# Altium schematic sheet SHEET1.SCHDOC
size A4
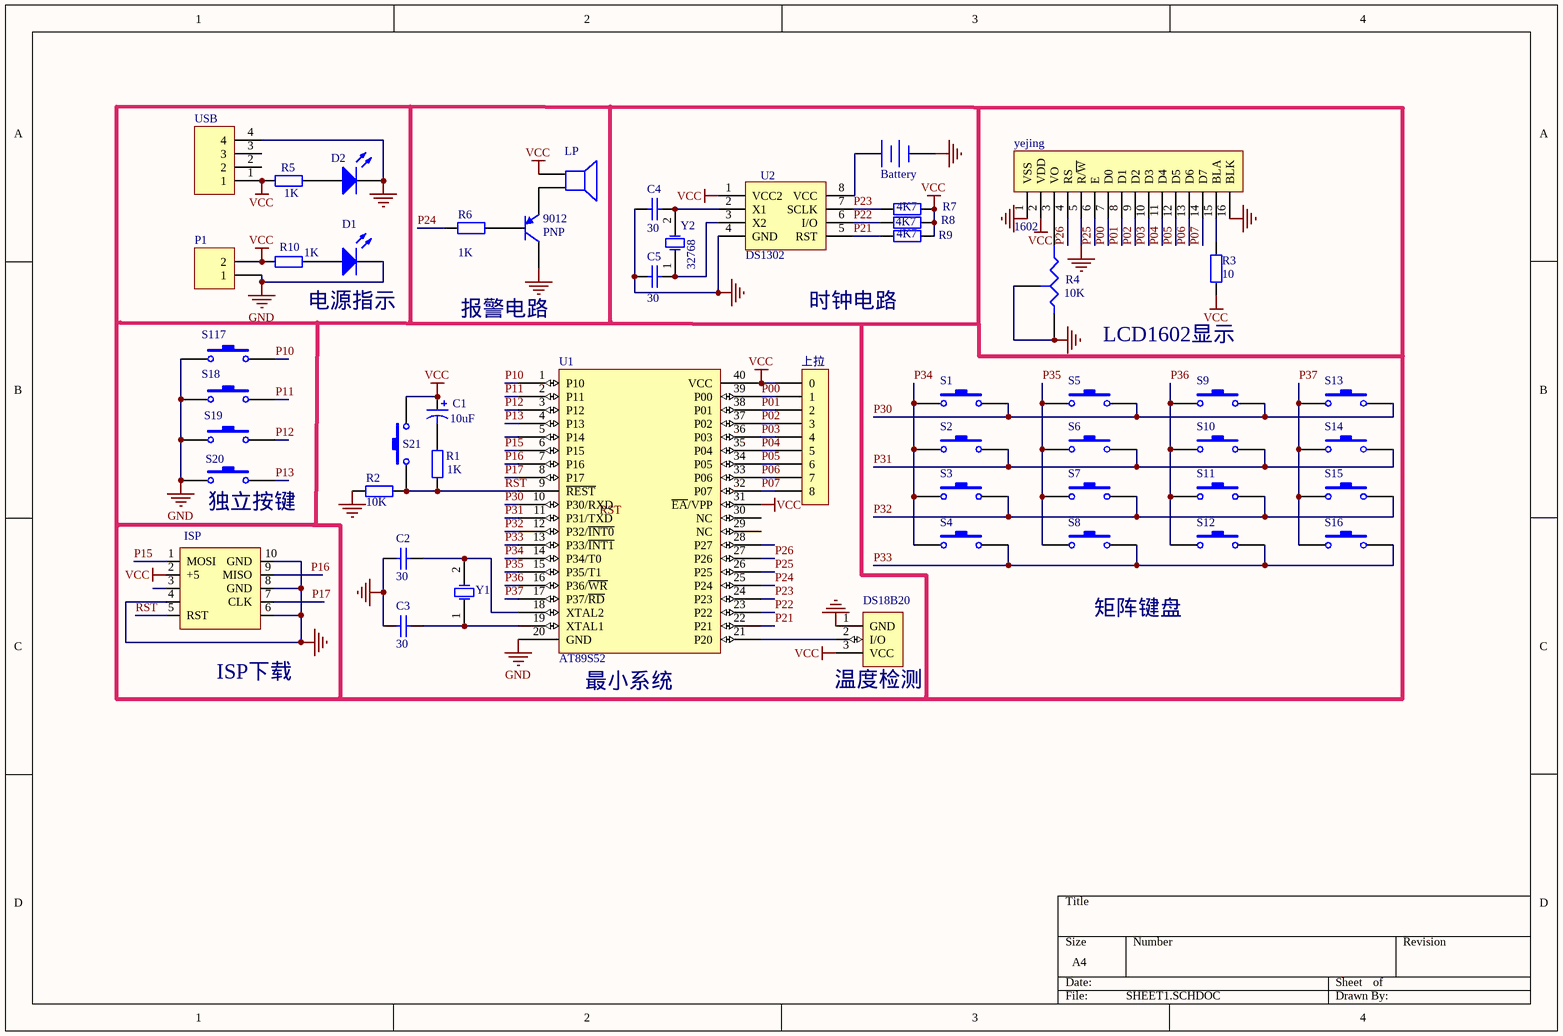
[diagram p0: SHEET1.SCHDOC]

## Parts
(Parts that share a designator on the sheet are numbered #1, #2 ... from top to bottom, then left to right.)
9012  PNP  [三极管]
*  DS18B20  [18B20]
?#1  上拉  [排阻]
?#2  ISP  [ISP]
BA1  Battery  [DIANZI]
C1  value 10uF  [电解电容]  (hidden comment: Cap Pol1)
C2  value 30  [cap]  (hidden comment: Cap)
C3  value 30  [cap]  (hidden comment: Cap)
C4  value 30  [cap]  (hidden comment: Cap)
C5  value 30  [cap]  (hidden comment: Cap)
D1  LED0  [led]  (value not drawn)
D2  LED0  [led]  (value not drawn)
LP  Speaker  [beep]  (value not drawn)
P1  Header 2  [电源]  (value not drawn)
R1  value 1K  [RES]  (hidden comment: Res2)
R2  value 10K  [res]  (hidden comment: Res2)
R3  value 10  [res]  (hidden comment: Res2)
R4  value 10K  [3CZ]  (hidden comment: Res Tap)
R5  value 1K  [RES]  (hidden comment: Res2)
R6  value 1K  [res]  (hidden comment: Res2)
R7  value 4K7  [res]  (hidden comment: Res2)
R8  value 4K7  [res]  (hidden comment: Res2)
R9  value 4K7  [res]  (hidden comment: Res2)
R10  value 1K  [res]  (hidden comment: Res2)
S1  按键  [AJ]  (value not drawn)
S2  按键  [AJ]  (value not drawn)
S3  按键  [AJ]  (value not drawn)
S4  按键  [AJ]  (value not drawn)
S5  按键  [AJ]  (value not drawn)
S6  按键  [AJ]  (value not drawn)
S7  按键  [AJ]  (value not drawn)
S8  按键  [AJ]  (value not drawn)
S9  按键  [AJ]  (value not drawn)
S10  按键  [AJ]  (value not drawn)
S11  按键  [AJ]  (value not drawn)
S12  按键  [AJ]  (value not drawn)
S13  按键  [AJ]  (value not drawn)
S14  按键  [AJ]  (value not drawn)
S15  按键  [AJ]  (value not drawn)
S16  按键  [AJ]  (value not drawn)
S18  SW-PB  [AJ]  (value not drawn)
S19  SW-PB  [AJ]  (value not drawn)
S20  SW-PB  [AJ]  (value not drawn)
S21  SW-PB  [AJ]  (value not drawn)
S117  SW-PB  [AJ]  (value not drawn)
U1  AT89S52  [AT89S52]
U2  DS1302  [DS1302]
USB  ?  [USB]  (value not drawn)
Y1  XTAL  [xtal]  (value not drawn)
Y2  32768  [xtalx]
yejing  1602  [1602]

## Nets
GND: 9012.1(C) *.1(GND) ?#2.4 ?#2.6 ?#2.8(GND) ?#2.10(GND) BA1.2(-) C2.2 C3.2 C4.1 C5.1 D1.2(K) D2.2(K) P1.1 R2.2 R4.1(A) R4.3(TAP) S18.1 S19.1 S20.1 S117.1 U1.20(GND) U2.4(GND) USB.4 yejing.1(VSS) yejing.5(R/~{W}) yejing.16(BLK)
VCC: *.3(VCC) ?#1.0 ?#2.2(+5) C1.1 LP.1 P1.2 R3.1 R5.1 R7.2 R8.2 R9.2 R10.1 S21.2 U1.31(~{EA}/VPP) U1.40(VCC) U2.1(VCC2) USB.1 yejing.2(VDD)
P00: ?#1.1 U1.39(P00) yejing.7(D0)
P01: ?#1.2 U1.38(P01) yejing.8(D1)
P02: ?#1.3 U1.37(P02) yejing.9(D2)
P03: ?#1.4 U1.36(P03) yejing.10(D3)
P04: ?#1.5 U1.35(P04) yejing.11(D4)
P05: ?#1.6 U1.34(P05) yejing.12(D5)
P06: ?#1.7 U1.33(P06) yejing.13(D6)
P07: ?#1.8 U1.32(P07) yejing.14(D7)
P10: S117.2 U1.1(P10)
P11: S18.2 U1.2(P11)
P12: S19.2 U1.3(P12)
P13: S20.2 U1.4(P13)
P15: ?#2.1(MOSI) U1.6(P15)
P16: ?#2.9(MISO) U1.7(P16)
P17: ?#2.7(CLK) U1.8(P17)
P21: R9.1 U1.22(P21) U2.5(RST)
P22: R8.1 U1.23(P22) U2.6(I/O)
P23: R7.1 U1.24(P23) U2.7(SCLK)
P24: R6.1 U1.25(P24)
P25: U1.26(P25) yejing.6(E)
P26: U1.27(P26) yejing.4(RS)
P30: S1.2 S5.2 S9.2 S13.2 U1.10(P30/RXD)
P31: S2.2 S6.2 S10.2 S14.2 U1.11(P31/TXD)
P32: S3.2 S7.2 S11.2 S15.2 U1.12(P32/~{INT0})
P33: S4.2 S8.2 S12.2 S16.2 U1.13(P33/~{INT1})
P34: S1.1 S2.1 S3.1 S4.1 U1.14(P34/T0)
P35: S5.1 S6.1 S7.1 S8.1 U1.15(P35/T1)
P36: S9.1 S10.1 S11.1 S12.1 U1.16(P36/~{WR})
P37: S13.1 S14.1 S15.1 S16.1 U1.17(P37/~{RD})
RST: ?#2.5(RST) R1.1 R2.1 S21.1 U1.9(~{REST})
Net9012_2: 9012.2(B) R6.2
Net9012_3: 9012.3(E) LP.2
Net*_2: *.2(I/O) U1.21(P20)
NetBA1_1: BA1.1(+) U2.8(VCC)
NetC1_2: C1.2 R1.2
NetC2_1: C2.1 U1.18(XTAL2) Y1.2(OSC2)
NetC3_1: C3.1 U1.19(XTAL1) Y1.1(OSC1)
NetC4_2: C4.2 U2.2(X1) Y2.2(OSC2)
NetC5_2: C5.2 U2.3(X2) Y2.1(OSC1)
NetD1_1: D1.1(A) R10.2
NetD2_1: D2.1(A) R5.2
NetR3_2: R3.2 yejing.15(BLA)
NetR4_2: R4.2(B) yejing.3(VO)

Not connected (* = marked no-connect by the designer): ?#2 3; U1 5(P14) 28(P27) 29(NC) 30(NC); USB 2 3

## Notes on the sheet
- 电源指示
- 时钟电路
- 报警电路
- LCD1602显示
- (near S20) 独立按键
- 矩阵键盘
- (near ?#2) ISP下载
- (near U1) 最小系统
- (near *) 温度检测
- Labels drawn without touching a wire or pin: RST

## Library data of the parts
9012 = PNP: PNP Bipolar Transistor; Published: 8-Jun-2000; LatestRevisionDate: 17-Jul-2002; LatestRevisionNote: Re-released for DXP Platform.; PackageReference: SOT-23B; Publisher: Altium Limited; Code_JEDEC: SOT-23
* = 18B20
?#1 = 排阻
BA1 = Battery: Multicell Battery; Published: 24-Mar-1999; LatestRevisionDate: 17-Jul-2002; LatestRevisionNote: Re-released for DXP Platform.; PackageReference: BAT-2; Publisher: Altium Limited
C1 = Cap Pol1: Polarized Capacitor (Radial); Published: 8-Jun-2000; LatestRevisionDate: 17-Jul-2002; LatestRevisionNote: Re-released for DXP Platform.; PackageReference: RB7.6-15; Publisher: Altium Limited
C2-C5 = Cap: Capacitor; Published: 8-Jun-2000; LatestRevisionDate: 17-Jul-2002; LatestRevisionNote: Re-released for DXP Platform.; PackageReference: RAD-0.3; Publisher: Altium Limited
D1 D2 = LED0: Typical INFRARED GaAs LED; Published: 8-Jun-2000; LatestRevisionDate: 08-Jul-2005; LatestRevisionNote: Mech Layer 1 removed.; PackageReference: LED-0; Publisher: Altium Limited
LP = Speaker: Loudspeaker; Published: 24-Mar-1999; LatestRevisionDate: 17-Jul-2002; LatestRevisionNote: Re-released for DXP Platform.; PackageReference: PIN2; Publisher: Altium Limited
P1 = Header 2: Header, 2-Pin; LatestRevisionDate: 17-Jul-2002; LatestRevisionNote: Re-released for DXP Platform.; Publisher: Altium Limited
R1-R3 R5-R10 = Res2: Resistor; Published: 8-Jun-2000; LatestRevisionDate: 17-Jul-2002; LatestRevisionNote: Re-released for DXP Platform.; PackageReference: AXIAL-0.4; Publisher: Altium Limited
R4 = Res Tap: Tapped Resistor; Sim Note: Enter the Resistance value and the set point into parameter fields.; Set Position: 0.5; Published: 24-Mar-1999; LatestRevisionDate: 17-Jul-2002; LatestRevisionNote: Re-released for DXP Platform.; PackageReference: VR3; Publisher: Altium Limited
S18-S21 S117 = SW-PB: Switch; Published: 24-Mar-1999; LatestRevisionDate: 17-Jul-2002; LatestRevisionNote: Re-released for DXP Platform.; PackageReference: SPST-2; Publisher: Altium Limited
USB = USB
Y1 Y2 = XTAL: Crystal Oscillator; Published: 8-Jun-2000; LatestRevisionDate: 17-Jul-2002; LatestRevisionNote: Re-released for DXP Platform.; PackageReference: R38; Publisher: Altium Limited